# EAGLE schematic attiny85_bo_1l (EAGLE 6.2)
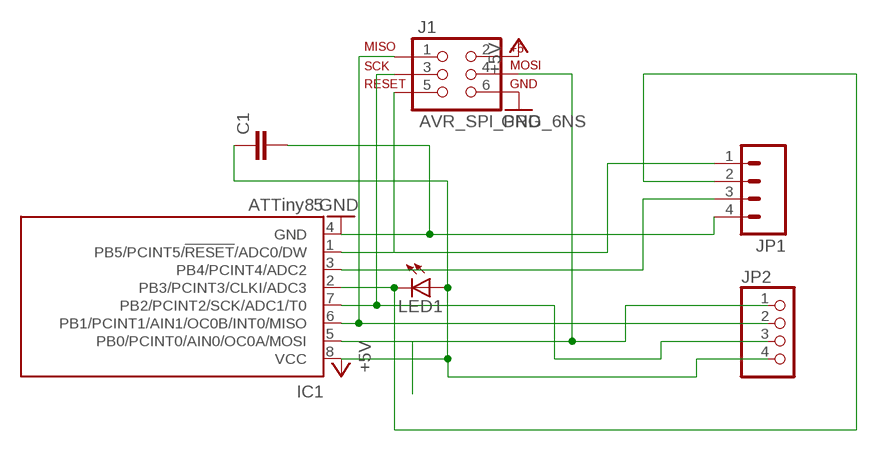
[diagram p0: schematic, sheet 1]

## Parts
C1  C-EUC0805  [C0805]
IC1  ATTiny85  TINY13-20SU  [8S2]
J1  AVR_SPI_PRG_6NS  [2X3-NS]
JP1  M041X04_NO_SILK  [1X04_NO_SILK]
JP2  PINHD-1X4  [1X04]
LED1  LED0603  [LED-0603]

## Nets
+5V: C1.1 IC1.8(VCC) J1.2 JP2.4 LED1.A
GND: C1.2 IC1.4(GND) J1.6 JP1.4
IN1/MISO: IC1.6(PB1/PCINT1/AIN1/OC0B/INT0/MISO) J1.1 JP2.2
N$1: IC1.3(PB4/PCINT4/ADC2) JP1.3
N$3: IC1.2(PB3/PCINT3/CLKI/ADC3) JP1.2 LED1.C
N$6: IC1.1(PB5/PCINT5/!RESET!/ADC0/DW) J1.5 JP1.1
SCL/SCK: IC1.7(PB2/PCINT2/SCK/ADC1/T0) J1.3 JP2.3
SDA/MOSI: IC1.5(PB0/PCINT0/AIN0/OC0A/MOSI) J1.4 JP2.1

## Library data of the parts
C1 = rcl:C-EU: CAPACITOR, European symbol
IC1 = atmel:TINY13: 8-bit AVR Microcontroller with 1K Bytes In-System Programmable Flash Source: http://www.atmel.com/dyn/resources/prod_documents/2535S.pdf; MPN: ATTINY13-20SU; OC_FARNELL: 9171568; OC_NEWARK: 96K6522
J1 = SparkFun-Connectors:AVR_SPI_PRG_6: AVR ISP 6 Pin This is the reduced ISP connector for AVR programming. Common on Arduino. This footprint will take up less PCB space and can be used with a 10-pin to 6-pin adapter such as SKU: BOB-08508
JP1 = SparkFun-Connectors:M04: Header 4 Standard 4-pin 0.1" header. Use with straight break away headers (SKU : PRT-00116), right angle break away headers (PRT-00553), swiss pins (PRT-00743), machine pins (PRT-00117), and female headers (PRT-00115). Molex polarized connector foot print use with SKU : PRT-08231 with associated crimp pins and housings. 1MM SMD Version SKU: PRT-10208
JP2 = pinhead:PINHD-1X4: PIN HEADER
LED1 = SparkFun-LED:LED: LEDs Standard schematic elements and footprints for 5mm, 3mm, 1206, and 0603 sized LEDs. 5mm - Spark Fun Electronics SKU : COM-00529 (and others)